# EAGLE design main (EAGLE 6.2)
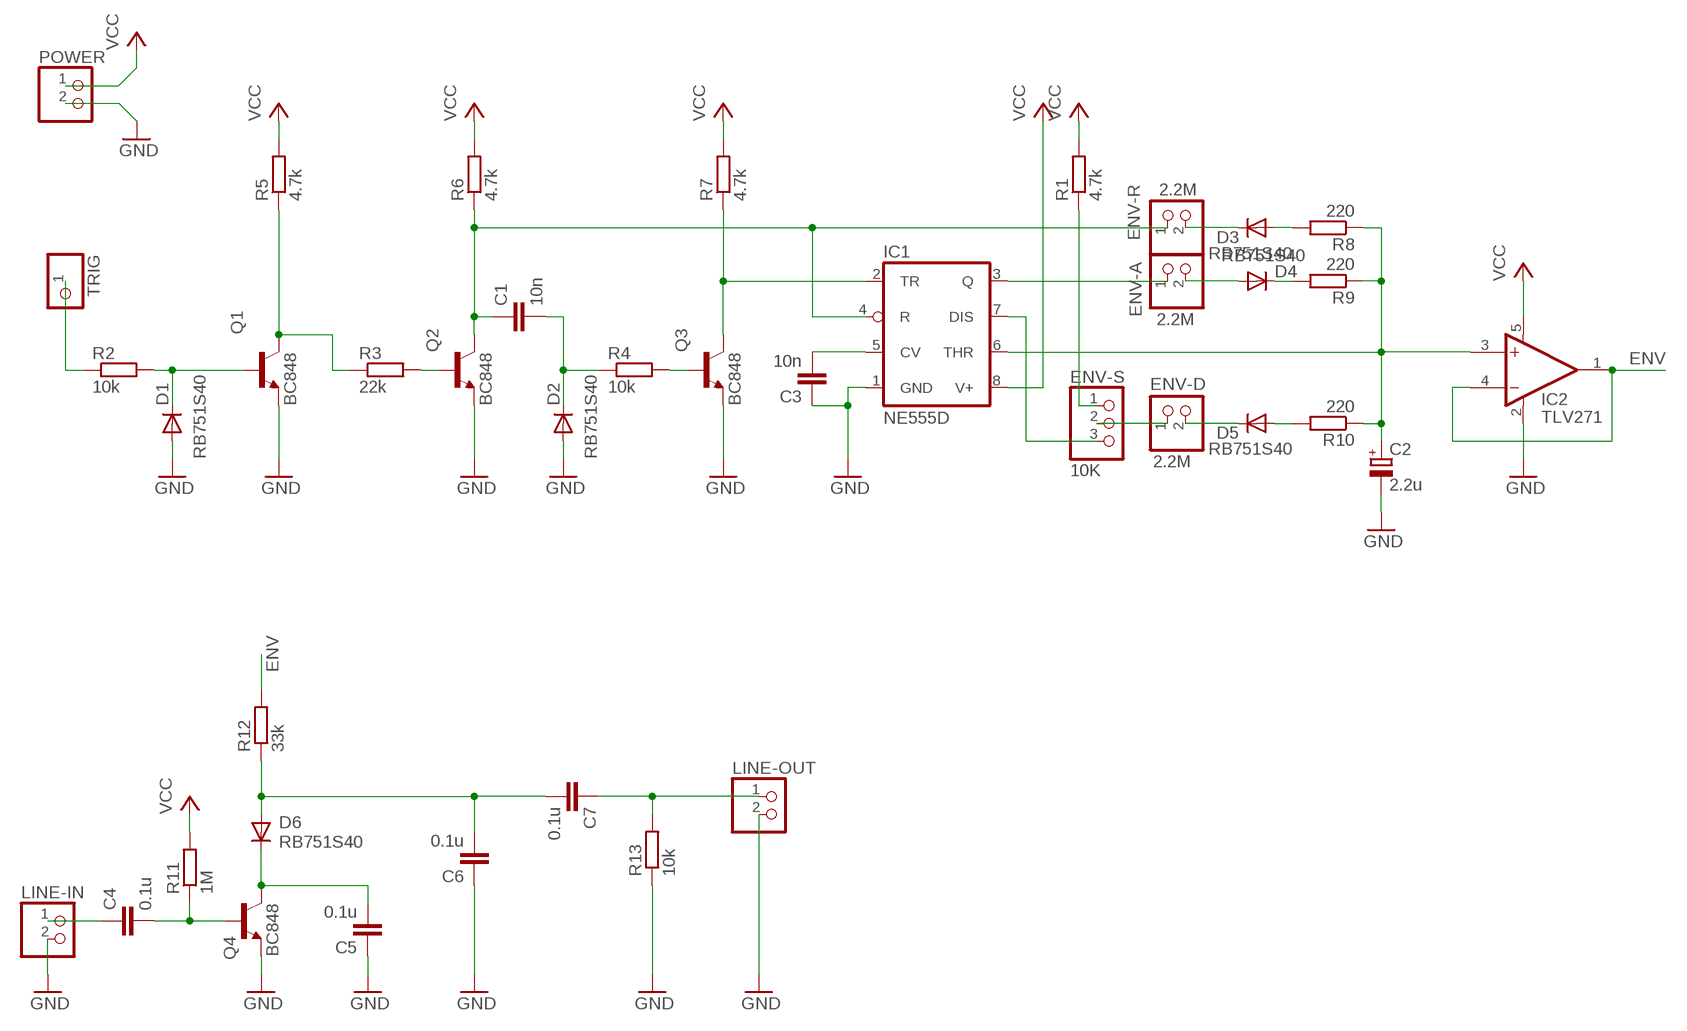
[diagram p0: schematic, sheet 1]

## Parts
C1  10n  C-EUC0805  [C0805]
C2  2.2u  CPOL-EUA  [PANASONIC_A]
C3  10n  C-EUC0805  [C0805]
C4  0.1u  C-EUC0805  [C0805]
C5  0.1u  C-EUC0805  [C0805]
C6  0.1u  C-EUC0805  [C0805]
C7  0.1u  C-EUC0805  [C0805]
D1  RB751S40  DIODE-SOD523  [SOD523]
D2  RB751S40  DIODE-SOD523  [SOD523]
D3  RB751S40  DIODE-SOD523  [SOD523]
D4  RB751S40  DIODE-SOD523  [SOD523]
D5  RB751S40  DIODE-SOD523  [SOD523]
D6  RB751S40  DIODE-SOD523  [SOD523]
ENV-A  2.2M  PINHD-1X02_2.00  [1X02M]
ENV-D  2.2M  PINHD-1X02_2.00  [1X02M]
ENV-R  2.2M  PINHD-1X02_2.00  [1X02M]
ENV-S  10K  PINHD-1X03_2.00  [1X03M]
IC1  NE555D  [SO08]
IC2  TLV271  TLV271-OP-AMP  [SOT23-5]
LINE-IN  PINHD-1X02_2.00  [1X02M]
LINE-OUT  PINHD-1X02_2.00  [1X02M]
POWER  PINHD-1X02_2.00  [1X02M]
Q1  BC848  BC848CLT1SMD  [SOT23]
Q2  BC848  BC848CLT1SMD  [SOT23]
Q3  BC848  BC848CLT1SMD  [SOT23]
Q4  BC848  BC848CLT1SMD  [SOT23]
R1  4.7k  R-EU_R0805W  [R0805W]
R2  10k  R-EU_R0805W  [R0805W]
R3  22k  R-EU_R0805W  [R0805W]
R4  10k  R-EU_R0805W  [R0805W]
R5  4.7k  R-EU_R0805W  [R0805W]
R6  4.7k  R-EU_R0805W  [R0805W]
R7  4.7k  R-EU_R0805W  [R0805W]
R8  220  R-EU_R0805W  [R0805W]
R9  220  R-EU_R0805W  [R0805W]
R10  220  R-EU_R0805W  [R0805W]
R11  1M  R-EU_R0805W  [R0805W]
R12  33k  R-EU_R0805W  [R0805W]
R13  10k  R-EU_R0805W  [R0805W]
TRIG  PINHD-1X01_2.00  [1X01M]

## Nets
ENV: IC2.1(OUT) IC2.4(-IN) R12.2
GND: C2.- C3.1 C5.1 C6.1 D1.A D2.A IC1.1(GND) IC2.2(V-) LINE-IN.2 LINE-OUT.2 POWER.2 Q1.2(E) Q2.2(E) Q3.2(E) Q4.2(E) R13.1
N$1: R2.1 TRIG.1
N$2: D1.C Q1.1(B) R2.2
N$3: Q1.3(C) R3.1 R5.1
N$4: Q2.1(B) R3.2
N$5: C1.1 ENV-R.1 IC1.4(R) Q2.3(C) R6.1
N$6: C1.2 D2.C R4.1
N$7: Q3.1(B) R4.2
N$8: C7.1 LINE-OUT.1 R13.2
N$9: D5.C ENV-D.2
N$10: ENV-D.1 ENV-S.2
N$11: ENV-S.3 IC1.7(DIS)
N$12: IC1.2(TR) Q3.3(C) R7.1
N$13: C3.2 IC1.5(CV)
N$14: D3.A R8.2
N$15: D3.C ENV-R.2
N$16: C2.+ IC1.6(THR) IC2.3(+IN) R8.1 R9.1 R10.1
N$17: ENV-A.1 IC1.3(Q)
N$18: D4.A ENV-A.2
N$19: D4.C R9.2
N$20: D5.A R10.2
N$21: ENV-S.1 R1.1
N$22: C4.1 LINE-IN.1
N$23: C4.2 Q4.1(B) R11.1
N$24: C5.2 D6.C Q4.3(C)
N$25: C6.2 C7.2 D6.A R12.1
VCC: IC1.8(V+) IC2.5(V+) POWER.1 R1.2 R5.2 R6.2 R7.2 R11.2

## Library data of the parts
C1 C3-C7 = rcl:C-EU: CAPACITOR, European symbol
C2 = rcl:CPOL-EU: POLARIZED CAPACITOR, European symbol
D1-D6 = diode:DIODE-: DIODE
ENV-A ENV-D ENV-R LINE-IN LINE-OUT POWER = pinhead-2:PINHD-1X02: PIN HEADER
ENV-S = pinhead-2:PINHD-1X03: PIN HEADER
IC1 = linear:*555: TIMER
IC2 = adam - ics:TLV271-OP-AMP
Q1-Q4 = transistor-npn:BC848*: NPN Transistor
R1-R13 = rcl:R-EU_: RESISTOR, European symbol
TRIG = pinhead-2:PINHD-1X01: PIN HEADER

## Board
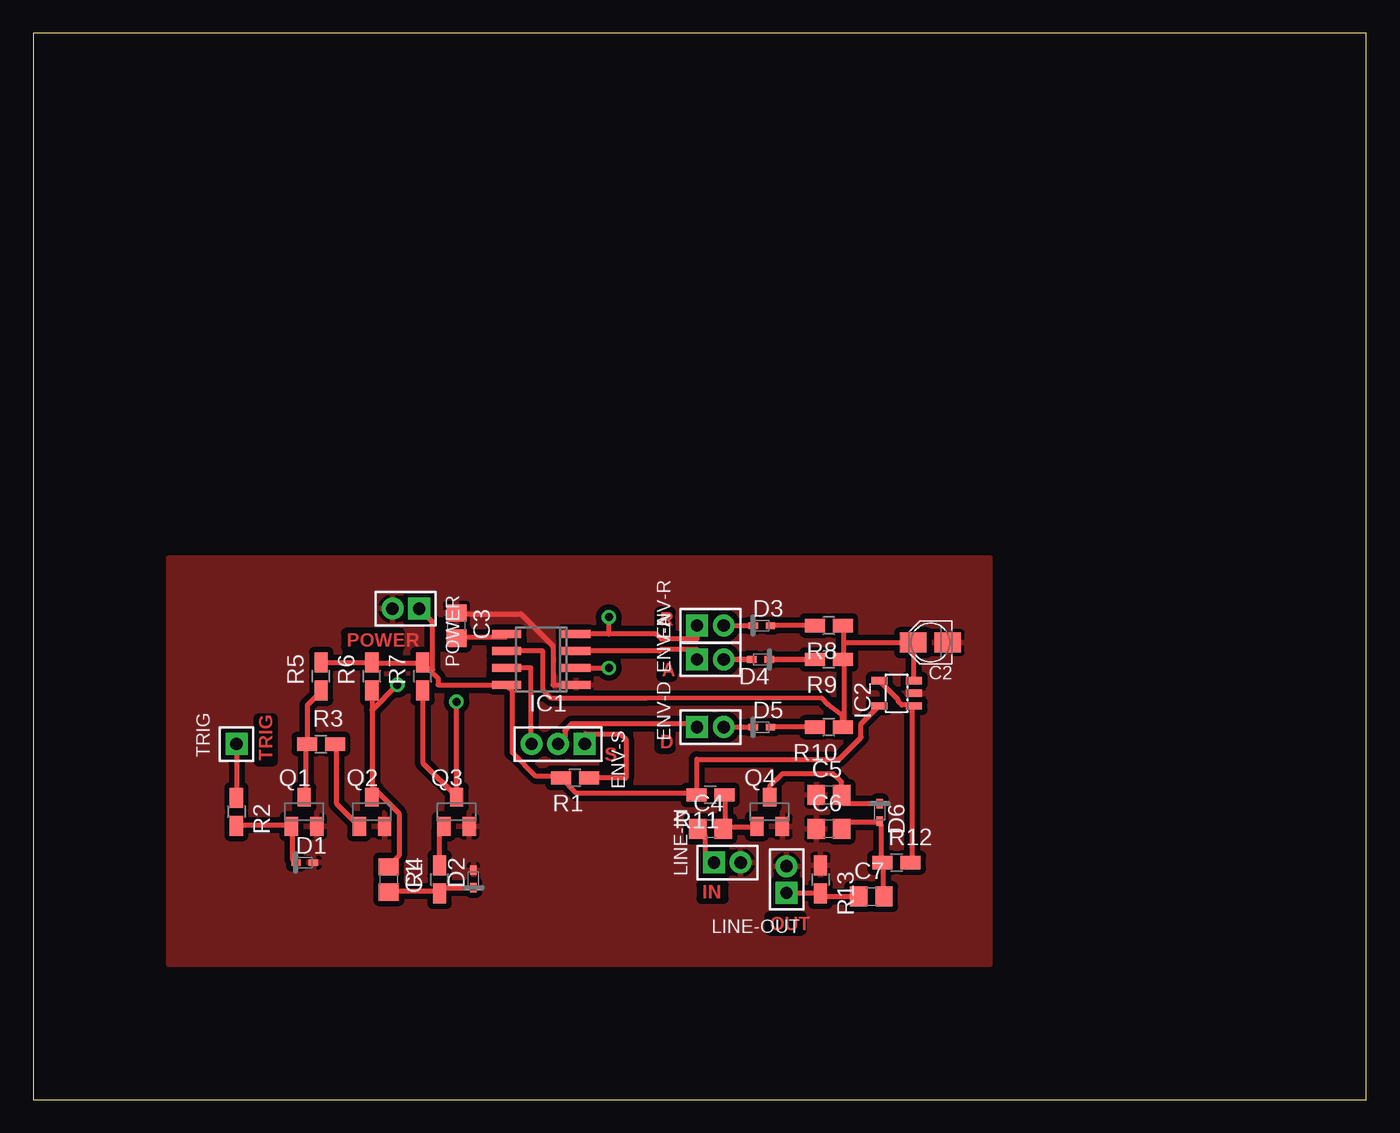
[diagram p1: board, top side]
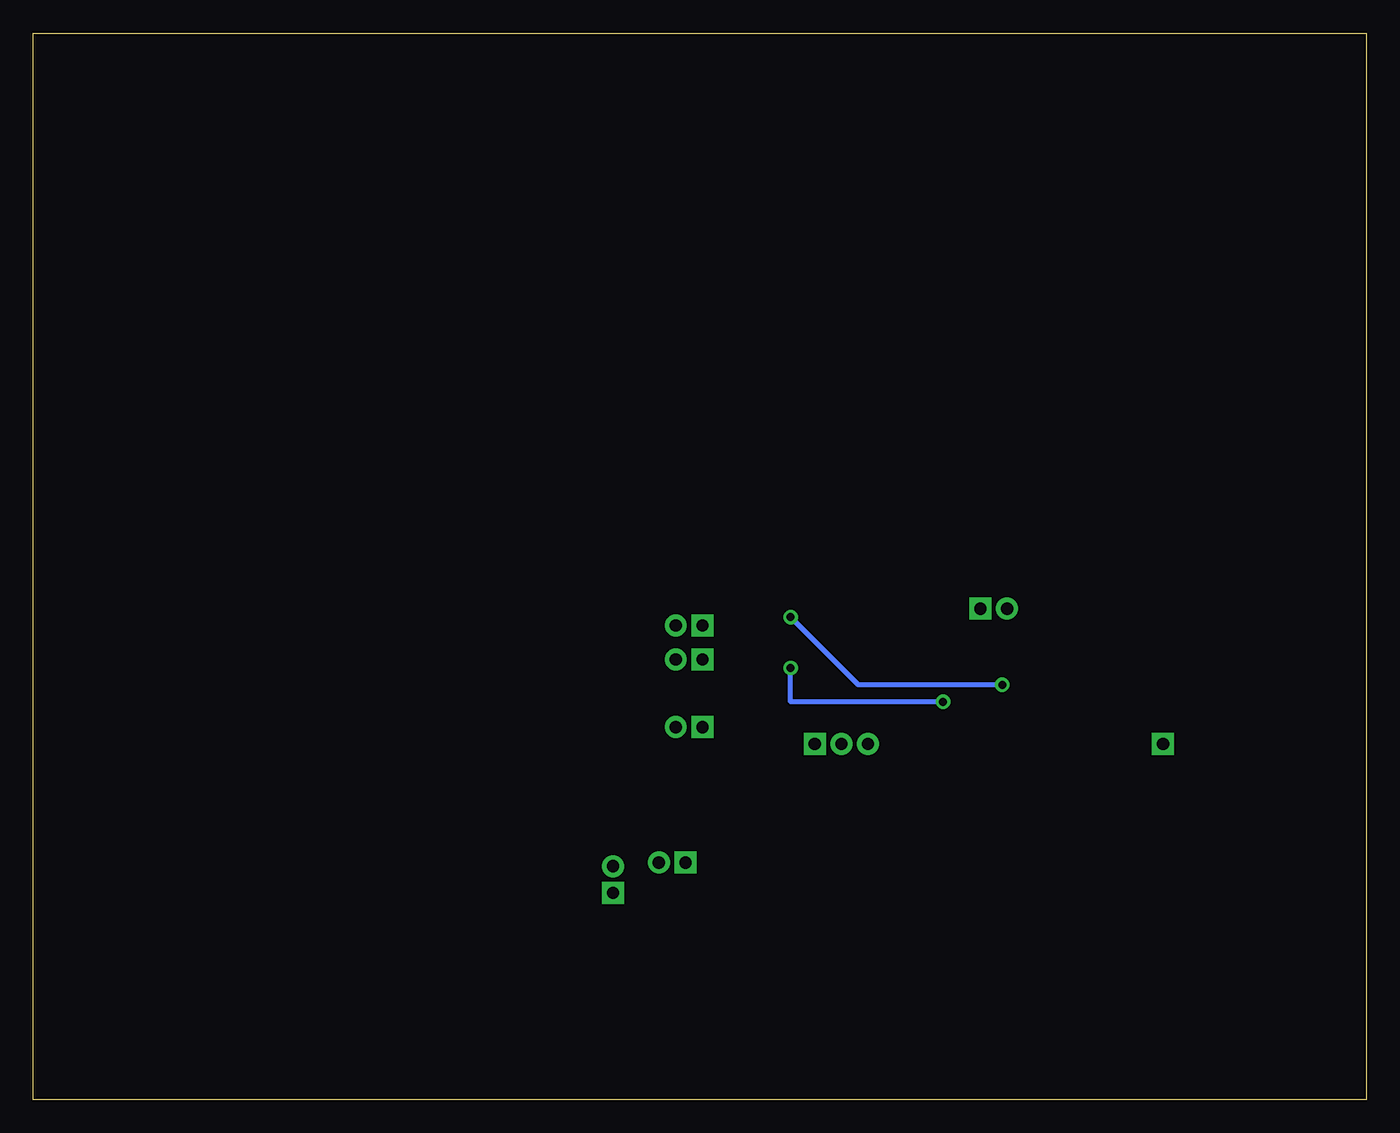
[diagram p2: board, bottom side, seen from below]

Size 100 x 80 mm. Coordinates in mm from the lower left corner, seen from the top.
Outline: 0,0 100,0 100,80 0,80 0,0
Copper layers (1*16): Top 0.035mm / dielectric 1.5mm / Bottom 0.035mm
Design rules: minimum track width 15mil, minimum drill 24mil, track to track 15mil, track to pad 15mil, pad to pad 8mil, via to via 12mil, smd to smd 8mil, copper to edge 40mil, drill to drill 8mil, minimum pad ring 10mil, minimum via ring 8mil, stop-mask expansion 4mil, vias tented up to drill 0mil, thermal gap 10mil

### Footprints (pad centres in the part's own frame; a part is rotated, then mirrored left to right if it is on the bottom)
C0805 = smd 1.3 x 1.5: 1 -0.95,0; 2 0.95,0
PANASONIC_A = smd 2 x 1.5: + 1.3,0; - -1.3,0
SOD523 = smd 0.7 x 0.5: A 0.7,0; C -0.6,0
1X02M = drill 0.914 square: 1 -1,0 | drill 0.914: 2 1,0
1X03M = drill 0.914 square: 1 -2,0 | drill 0.914: 2 0,0; 3 2,0
SO08 = smd 0.6 x 2.2: 1 -1.905,-2.6; 2 -0.635,-2.6; 3 0.635,-2.6; 4 1.905,-2.6; 5 1.905,2.6; 6 0.635,2.6; 7 -0.635,2.6; 8 -1.905,2.6
SOT23-5 = smd 0.55 x 1.2: 1 -0.95,-1.3; 2 0,-1.3; 3 0.95,-1.3; 4 0.95,1.3; 5 -0.95,1.3
SOT23 = smd 1 x 1.4: 1 -0.95,-1.1; 2 0.95,-1.1; 3 0,1.1
R0805W = smd 1.5 x 1: 1 -1.052,0; 2 1.052,0
1X01M = drill 0.914 square: 1 0,0

### Placement (x,y rotation side)
C1  26.67,16.51 270 top
C2  67.31,34.29 180 top
C3  31.75,35.56 270 top
C4  50.8,20.32 0 top
C5  59.69,22.86 0 top
C6  59.69,20.32 0 top
C7  62.87,15.24 0 top
D1  20.32,17.78 0 top
D2  33.02,16.51 90 top
D3  54.61,35.56 0 top
D4  54.61,33.02 180 top
D5  54.61,27.94 0 top
D6  63.5,21.59 270 top
ENV-A  50.8,33.02 0 top
ENV-D  50.8,27.94 0 top
ENV-R  50.8,35.56 0 top
ENV-S  39.37,26.67 180 top
IC1  38.1,33.02 90 top
IC2  64.77,30.48 90 top
LINE-IN  52.07,17.78 0 top
LINE-OUT  56.52,16.51 90 top
POWER  27.94,36.83 180 top
Q1  20.32,21.59 0 top
Q2  25.4,21.59 0 top
Q3  31.75,21.59 0 top
Q4  55.24,21.59 0 top
R1  40.64,24.13 180 top
R2  15.24,21.59 270 top
R3  21.59,26.67 0 top
R4  30.48,16.51 90 top
R5  21.59,31.75 90 top
R6  25.4,31.75 90 top
R7  29.21,31.75 90 top
R8  59.69,35.56 180 top
R9  59.69,33.02 180 top
R10  59.69,27.94 180 top
R11  50.8,22.86 180 top
R12  64.77,17.78 0 top
R13  59.05,16.51 270 top
TRIG  15.24,26.67 0 top

### Tracks (layer width: path | path; a pad name or v marks a point on that pad's centre or on a via)
ENV
  Top 0.381: IC2.4 63.5,31.37 64.9,29.97 64.9,29.84 65.15,29.59 66.04,29.59 IC2.1 65.91,29.46 65.91,17.78 R12.2
GND
  Top 0.381: IC1.1 38.99,31.11 38.99,34.04 36.58,36.45 31.75,36.45 C3.1
  pour Top (isolate 0.406): 10.16,40.64 71.75,40.64 71.75,10.16 10.16,10.16
N$1
  Top 0.381: TRIG.1 R2.1
N$2
  Top 0.381: D1.C 19.68,17.78 19.43,18.03 19.43,20.45 Q1.1 19.3,20.57 15.24,20.57 R2.2
N$3
  Top 0.381: Q1.3 20.32,22.73 20.45,22.86 20.45,26.67 R3.1 20.57,26.8 20.57,29.59 21.59,30.61 R5.1
N$4
  Top 0.381: Q2.1 24.38,20.57 22.73,22.23 22.73,26.67 R3.2
N$5  (via drill 0.6)
  Top 0.381: 43.18,34.92 46.74,34.92 47.12,34.54 49.78,34.54 49.78,35.56 ENV-R.1 | 43.18,34.92 IC1.4 | R6.1 25.4,29.21 | 25.4,29.21 Q2.3 25.53,23.37 27.43,21.46 27.43,18.29 26.67,17.53 C1.1 | 43.18,34.92 v43.18,36.2 | 25.4,29.21 v27.3,31.11
  Bottom 0.381: v43.18,36.2 38.1,31.11 v27.3,31.11
N$6
  Top 0.381: D2.C 33.02,15.88 30.48,15.88 R4.1 30.35,15.62 26.67,15.62 C1.2
N$7
  Top 0.381: R4.2 30.48,20.19 30.73,20.45 Q3.1
N$8
  Top 0.381: LINE-OUT.1 56.52,15.49 59.05,15.49 R13.2 59.18,15.37 59.18,15.24 C7.1
N$9
  Top 0.381: ENV-D.2 D5.C
N$10
  Top 0.381: ENV-S.2 39.88,27.18 39.88,27.69 40.39,28.19 49.78,28.19 49.78,27.94 ENV-D.1
N$11
  Top 0.381: IC1.7 37.34,32.38 37.34,26.67 ENV-S.3
N$12  (via drill 0.6)
  Top 0.381: R7.1 29.21,25.27 31.75,22.73 Q3.3 v31.75,29.84 | IC1.2 v43.18,32.38
  Bottom 0.381: v43.18,32.38 43.18,29.84 v31.75,29.84
N$13
  Top 0.381: C3.2 31.75,34.67 35.43,34.67 35.43,34.92 IC1.5
N$14
  Top 0.381: R8.2 D3.A
N$15
  Top 0.381: ENV-R.2 D3.C
N$16
  Top 0.381: IC2.3 66.04,31.5 66.04,34.29 C2.+ 60.83,34.29 | 60.83,34.29 60.83,33.15 R9.1 60.83,33.02 60.83,27.94 R10.1 60.71,28.13 60.71,28.83 59.66,29.62 59.15,30.13 45.97,30.1 38.86,30.1 38.23,30.73 38.23,33.66 IC1.6 | 60.83,34.29 60.83,35.56 R8.1
N$17
  Top 0.381: IC1.3 46.99,33.66 47.12,33.78 49.78,33.78 49.78,33.02 ENV-A.1
N$18
  Top 0.406: D4.A ENV-A.2
N$19
  Top 0.406: D4.C R9.2
N$20
  Top 0.381: R10.2 D5.A
N$21
  Top 0.381: R1.1 44.45,24.13 44.45,27.05 44.07,27.43 41.4,27.43 41.4,26.67 ENV-S.1
N$22
  Top 0.381: C4.1 49.91,20.32 50.42,19.81 50.42,18.41 51.05,17.78 LINE-IN.1
N$23
  Top 0.381: Q4.1 54.23,20.45 51.82,20.45 51.82,20.32 C4.2 51.94,20.57 51.94,22.86 R11.1
N$24
  Top 0.381: D6.C 63.5,22.23 60.71,22.23 60.71,22.86 C5.2 60.64,23.82 60.01,24.45 56.2,24.45 55.24,23.5 Q4.3
N$25
  Top 0.381: C6.2 60.71,20.32 60.71,20.83 63.5,20.83 D6.A 63.5,20.7 63.63,20.57 63.63,17.91 R12.1 63.75,17.78 63.75,15.24 C7.2
VCC
  Top 0.381: R5.2 21.59,32.77 25.4,32.77 R6.2 25.53,32.77 29.21,32.77 R7.2 29.34,32.64 29.84,32.13 | 29.84,32.13 30.35,31.62 30.35,31.11 IC1.8 35.56,30.99 35.94,30.61 35.94,26.04 37.72,24.26 39.5,24.26 R1.2 39.62,24.13 40.77,22.99 49.66,22.99 R11.2 49.78,22.86 49.78,25.53 60.45,25.53 62.1,27.18 62.1,28.19 63.37,29.46 IC2.5 | POWER.1 28.96,36.83 29.97,35.81 29.97,32.26 29.84,32.13

### Text on the board
Top: R | POWER | A | D | TRIG | S | IN | OUT